# Altium schematic sheet SensorsConnectors.SchDoc
size A4
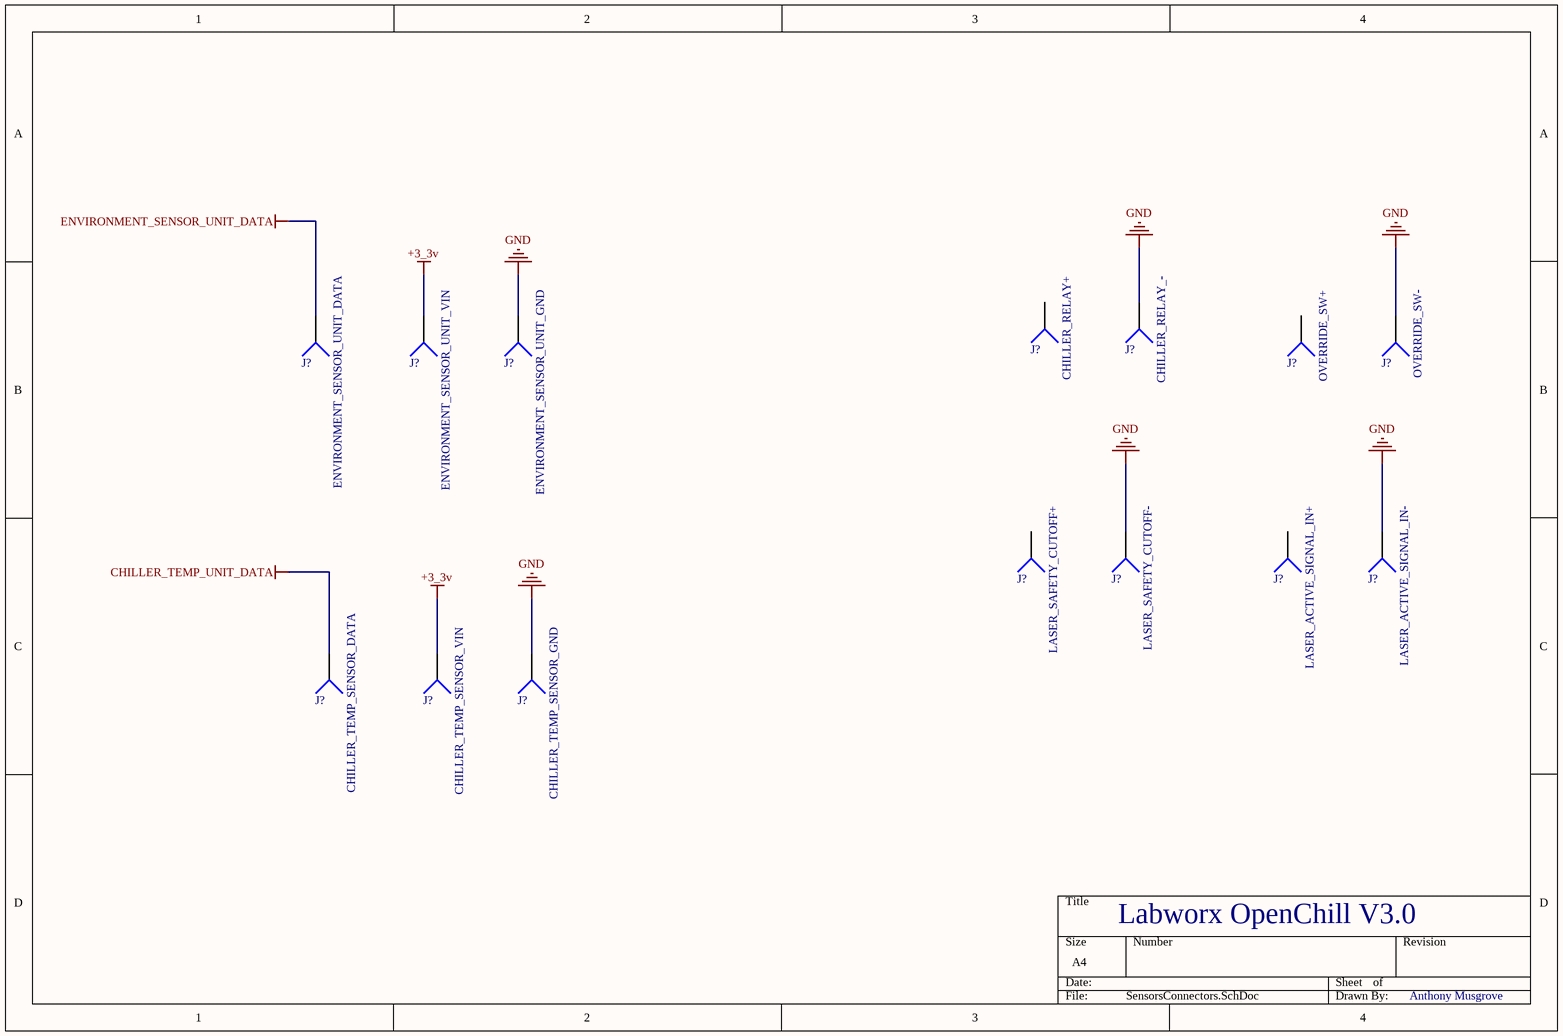
[diagram p0: SensorsConnectors.SchDoc]

## Parts
(Parts that share a designator on the sheet are numbered #1, #2 ... from top to bottom, then left to right.)
J?#1  CHILLER_RELAY+  [PIN1]
J?#2  CHILLER_RELAY_-  [PIN1]
J?#3  ENVIRONMENT_SENSOR_UNIT_DATA  [PIN1]
J?#4  ENVIRONMENT_SENSOR_UNIT_VIN  [PIN1]
J?#5  ENVIRONMENT_SENSOR_UNIT_GND  [PIN1]
J?#6  OVERRIDE_SW+  [PIN1]
J?#7  OVERRIDE_SW-  [PIN1]
J?#8  LASER_SAFETY_CUTOFF+  [PIN1]
J?#9  LASER_SAFETY_CUTOFF-  [PIN1]
J?#10  LASER_ACTIVE_SIGNAL_IN+  [PIN1]
J?#11  LASER_ACTIVE_SIGNAL_IN-  [PIN1]
J?#12  CHILLER_TEMP_SENSOR_DATA  [PIN1]
J?#13  CHILLER_TEMP_SENSOR_VIN  [PIN1]
J?#14  CHILLER_TEMP_SENSOR_GND  [PIN1]

## Nets
+3_3v: J?#4.1 J?#13.1
CHILLER_TEMP_UNIT_DATA: J?#12.1
ENVIRONMENT_SENSOR_UNIT_DATA: J?#3.1
GND: J?#2.1 J?#5.1 J?#7.1 J?#9.1 J?#11.1 J?#14.1

Not connected (* = marked no-connect by the designer): J?#1 1; J?#6 1; J?#8 1; J?#10 1

## Notes on the sheet
- Labworx OpenChill V3.0
- Anthony Musgrove

## Library data of the parts
J?#1-J?#14 = Socket: THERMISTOR (P1); LatestRevisionDate: 17-Jul-2002; LatestRevisionNote: Re-released for DXP Platform.; Publisher: Altium Limited